# Altium schematic sheet MUX.SchDoc
size 101 x 101 mm; SheetNumber: 5; SheetTotal: 7
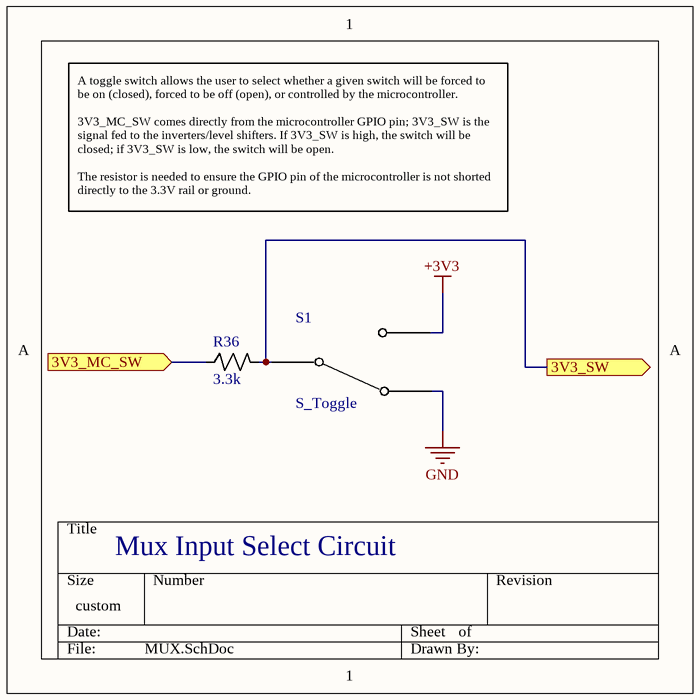
[diagram p0: MUX.SchDoc]

## Parts
R36  3.3k  [0603_RES]
S1  S_Toggle  [TOGGLE]

## Ports
3V3_MC_SW (in, see Load_Bank_Master[3C]), 3V3_SW (out, see Load_Bank_Master[3C])

## Nets
+3V3: S1.3
GND: S1.1
3V3_MC_SW: R36.1 ; port 3V3_MC_SW
3V3_SW: R36.2 S1.2 ; port 3V3_SW

## Notes on the sheet
- A toggle switch allows the user to select whether a given switch will be forced to be on (closed), forced to be off (open), or controlled by the microcontroller.
  3V3_MC_SW comes directly from the microcontroller GPIO pin; 3V3_SW is the signal fed to the inverters/level shifters. If 3V3_SW is high, the switch will be closed; if 3V3_SW is low, the switch will be open.
  The resistor is needed to ensure the GPIO pin of the microcontroller is not shorted directly to the 3.3V rail or ground.
- Mux Input Select Circuit

## Library data of the parts
R36 = R_3300Ohm_0603_1%: Resistor 3.3 kOhm 0603 1%
S1 = S_Toggle: Switch Toggle